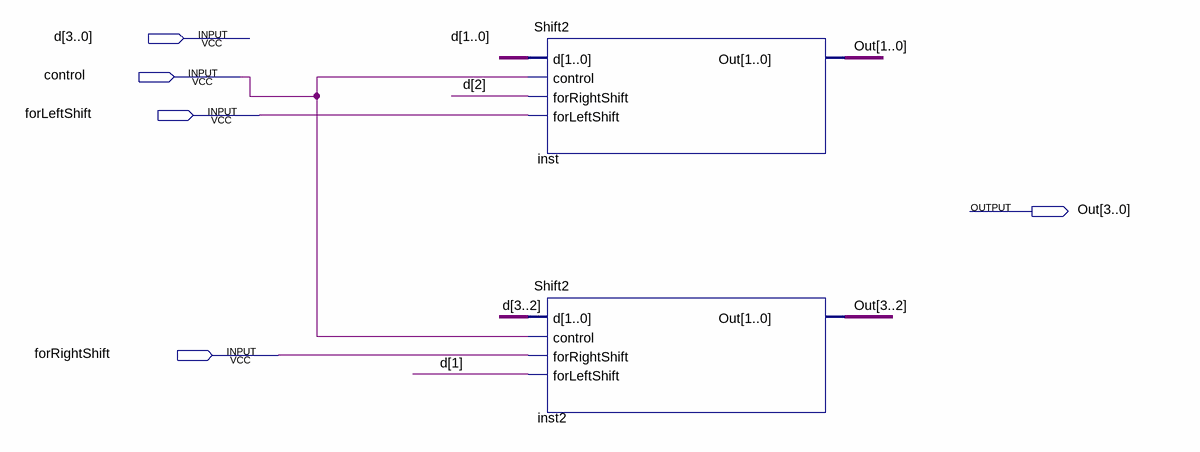
[diagram p0: schematic sheet]
// Quartus schematic Shift4.bdf as structural Verilog: 2 symbols, 5 pins
module Shift4 (
  input  [3:0] d,
  input  control,
  input  forLeftShift,
  input  forRightShift,
  output [3:0] Out
);

  Shift2 inst (.d(d[1:0]), .control(control), .forRightShift(d[2]), .forLeftShift(forLeftShift), .Out(Out[1:0]));
  Shift2 inst2 (.d(d[3:2]), .control(control), .forRightShift(forRightShift), .forLeftShift(d[1]), .Out(Out[3:2]));
endmodule
